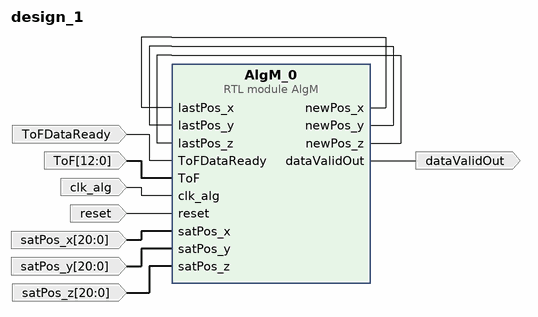
[diagram p0: block diagram of the top level]
# Vivado block design design_1, xc7a35tcpg236-1, Vivado 2024.1.2
create_bd_design design_1

create_bd_port -dir O dataValidOut
create_bd_port -dir I -type clk clk_alg
set_property -dict {CONFIG.FREQ_HZ 12000000} [get_bd_ports clk_alg]
create_bd_port -dir I ToFDataReady
create_bd_port -dir I -from 12 -to 0 ToF
create_bd_port -dir I -type rst reset
create_bd_port -dir I -from 20 -to 0 satPos_x
create_bd_port -dir I -from 20 -to 0 satPos_y
create_bd_port -dir I -from 20 -to 0 satPos_z

create_bd_cell -type module -reference AlgM AlgM_0

# ---- connections ----

connect_bd_net [get_bd_pins AlgM_0/dataValidOut] [get_bd_ports dataValidOut]
connect_bd_net [get_bd_pins AlgM_0/newPos_x] [get_bd_pins AlgM_0/lastPos_x]
connect_bd_net [get_bd_pins AlgM_0/newPos_y] [get_bd_pins AlgM_0/lastPos_y]
connect_bd_net [get_bd_pins AlgM_0/newPos_z] [get_bd_pins AlgM_0/lastPos_z]
connect_bd_net [get_bd_ports ToFDataReady] [get_bd_pins AlgM_0/ToFDataReady]
connect_bd_net [get_bd_ports ToF] [get_bd_pins AlgM_0/ToF]
connect_bd_net [get_bd_ports clk_alg] [get_bd_pins AlgM_0/clk_alg]
connect_bd_net [get_bd_ports reset] [get_bd_pins AlgM_0/reset]
connect_bd_net [get_bd_ports satPos_x] [get_bd_pins AlgM_0/satPos_x]
connect_bd_net [get_bd_ports satPos_y] [get_bd_pins AlgM_0/satPos_y]
connect_bd_net [get_bd_ports satPos_z] [get_bd_pins AlgM_0/satPos_z]

validate_bd_design
save_bd_design
